# EasyEDA Pro project ProPrj_STM32F405RGT6机器人主控板_2024-12-01.epro, schematic Schematic1

## Sheets
1 P1: Create Date: 2024-09-21; Page Name: P1; Project Name: STM32F405RGT6机器人主控板; Schematic Name: Schematic1; Update Date: 2024-09-21; Company: 嘉立创EDA; Page Size: A4; Version: V1.0
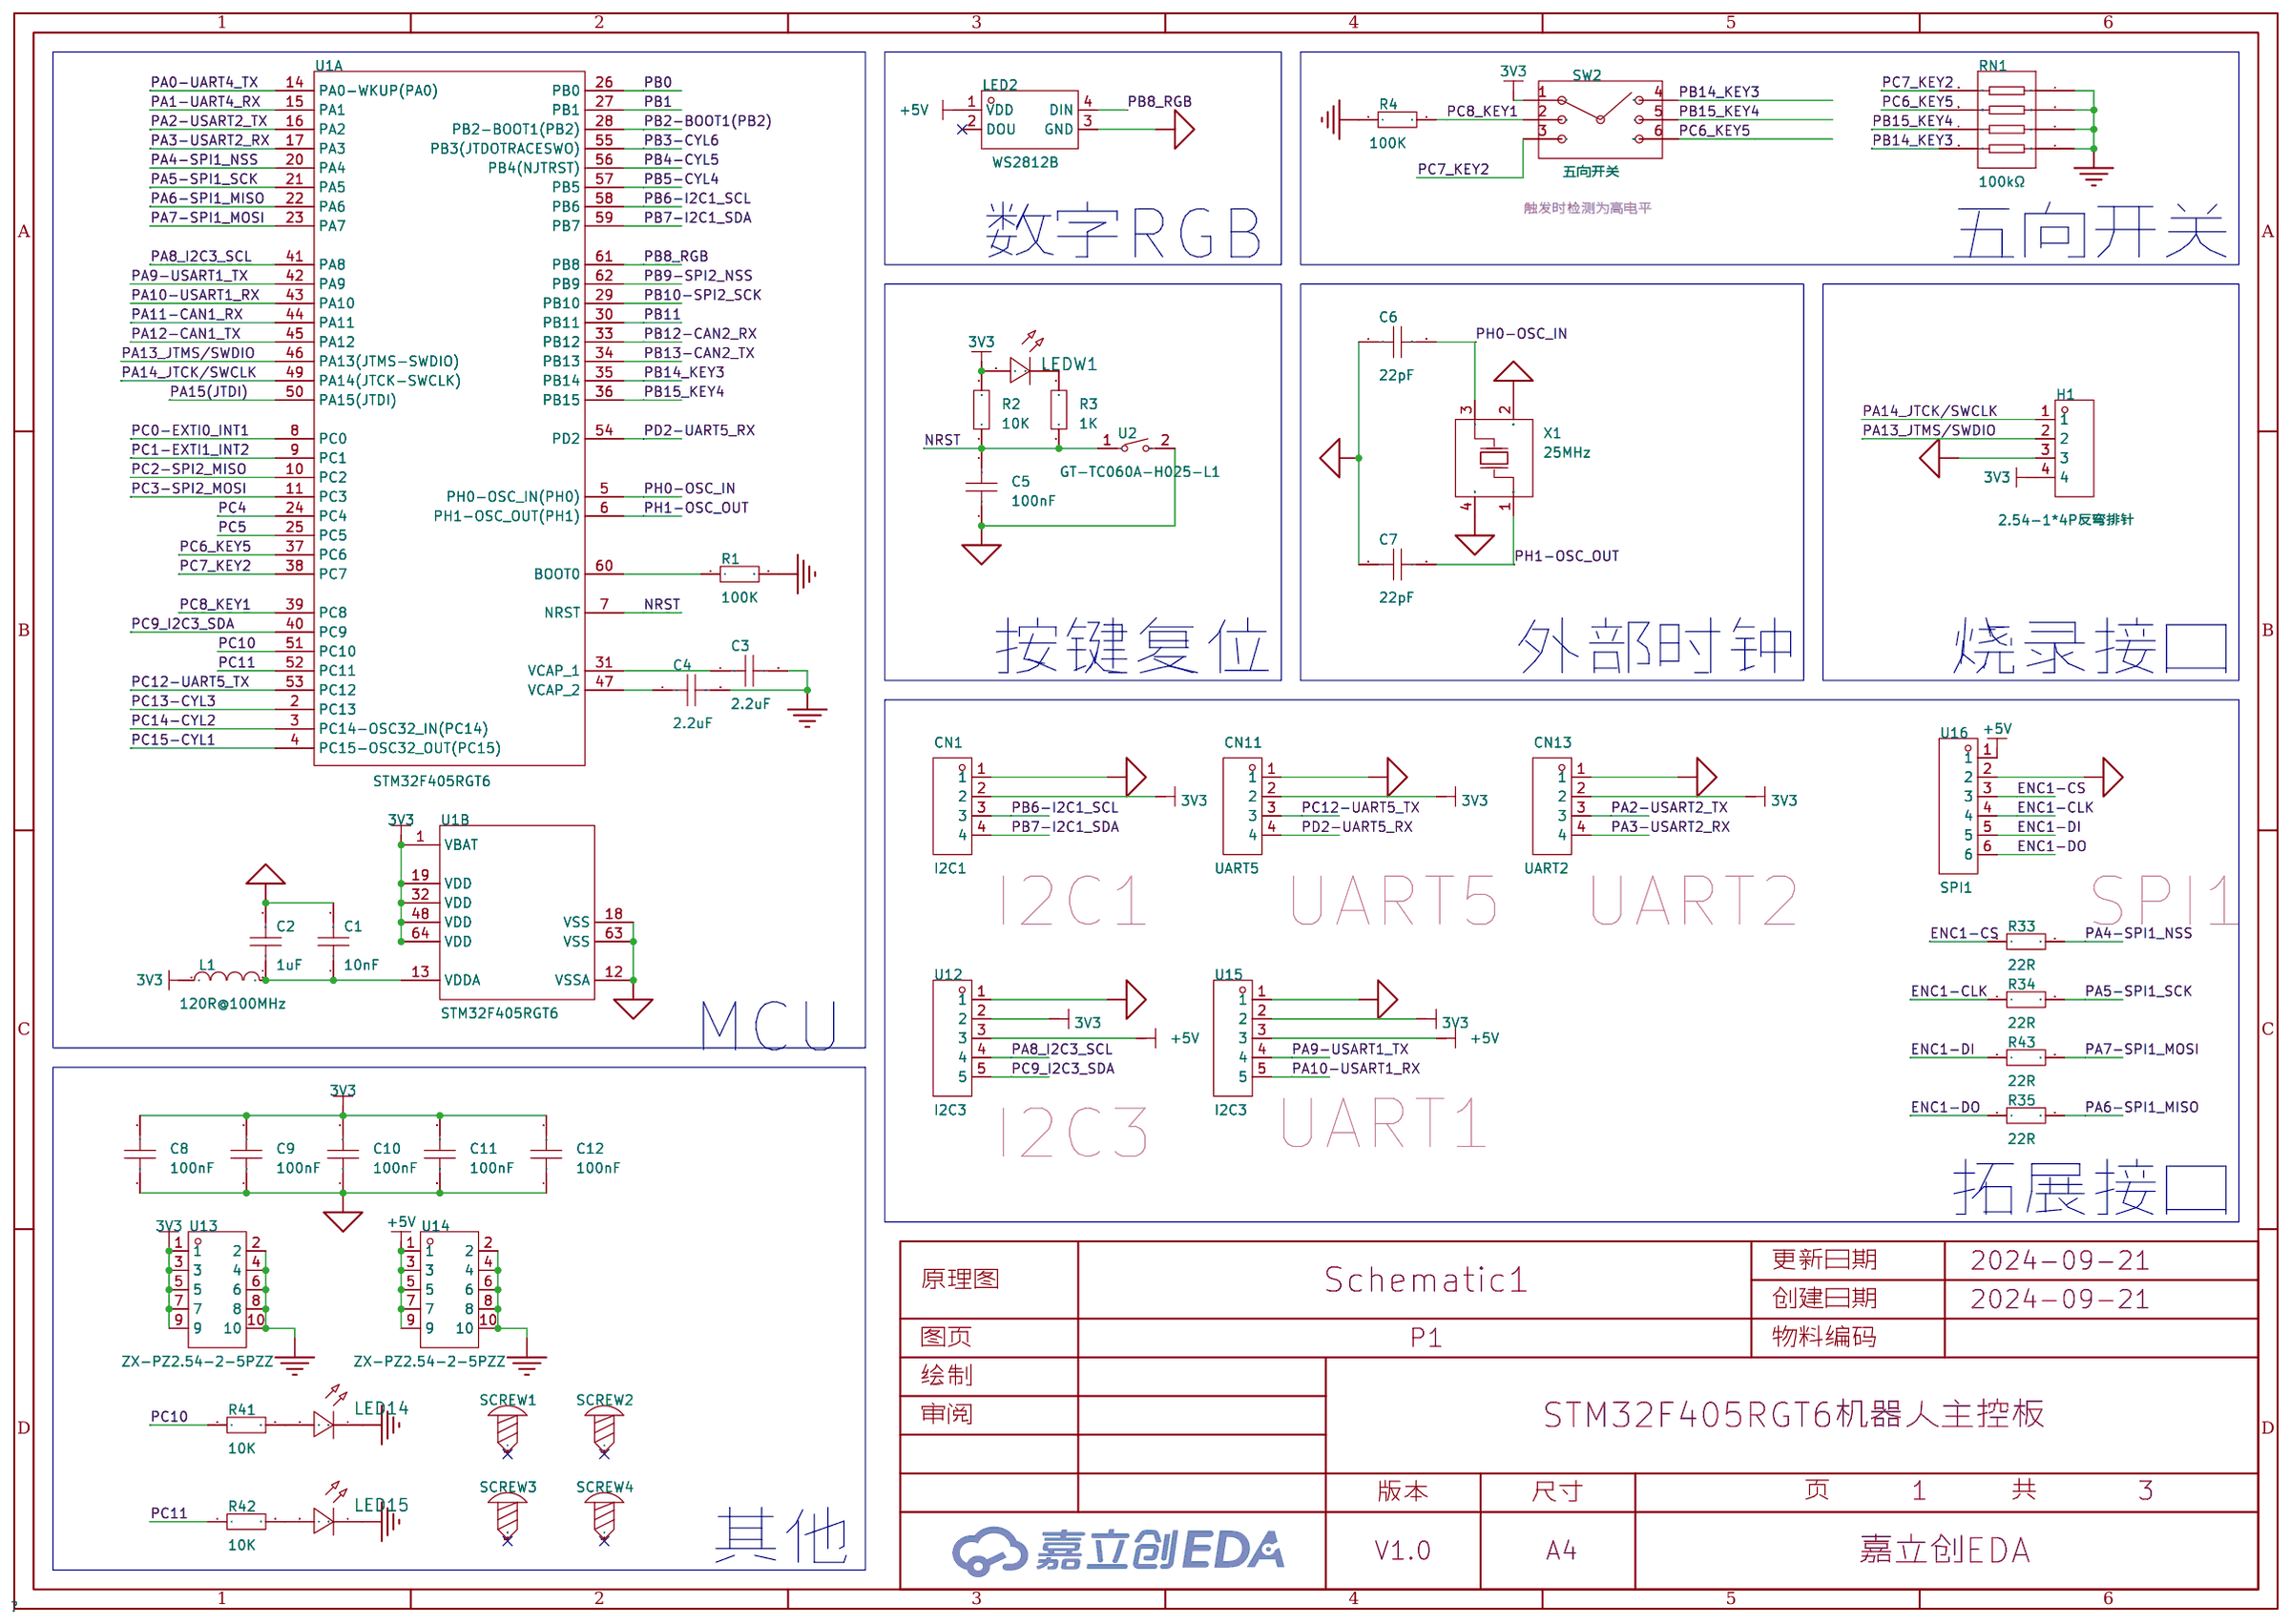
[diagram p0: P1]
2 P2: Page Name: P2; Update Date: 2024-09-22
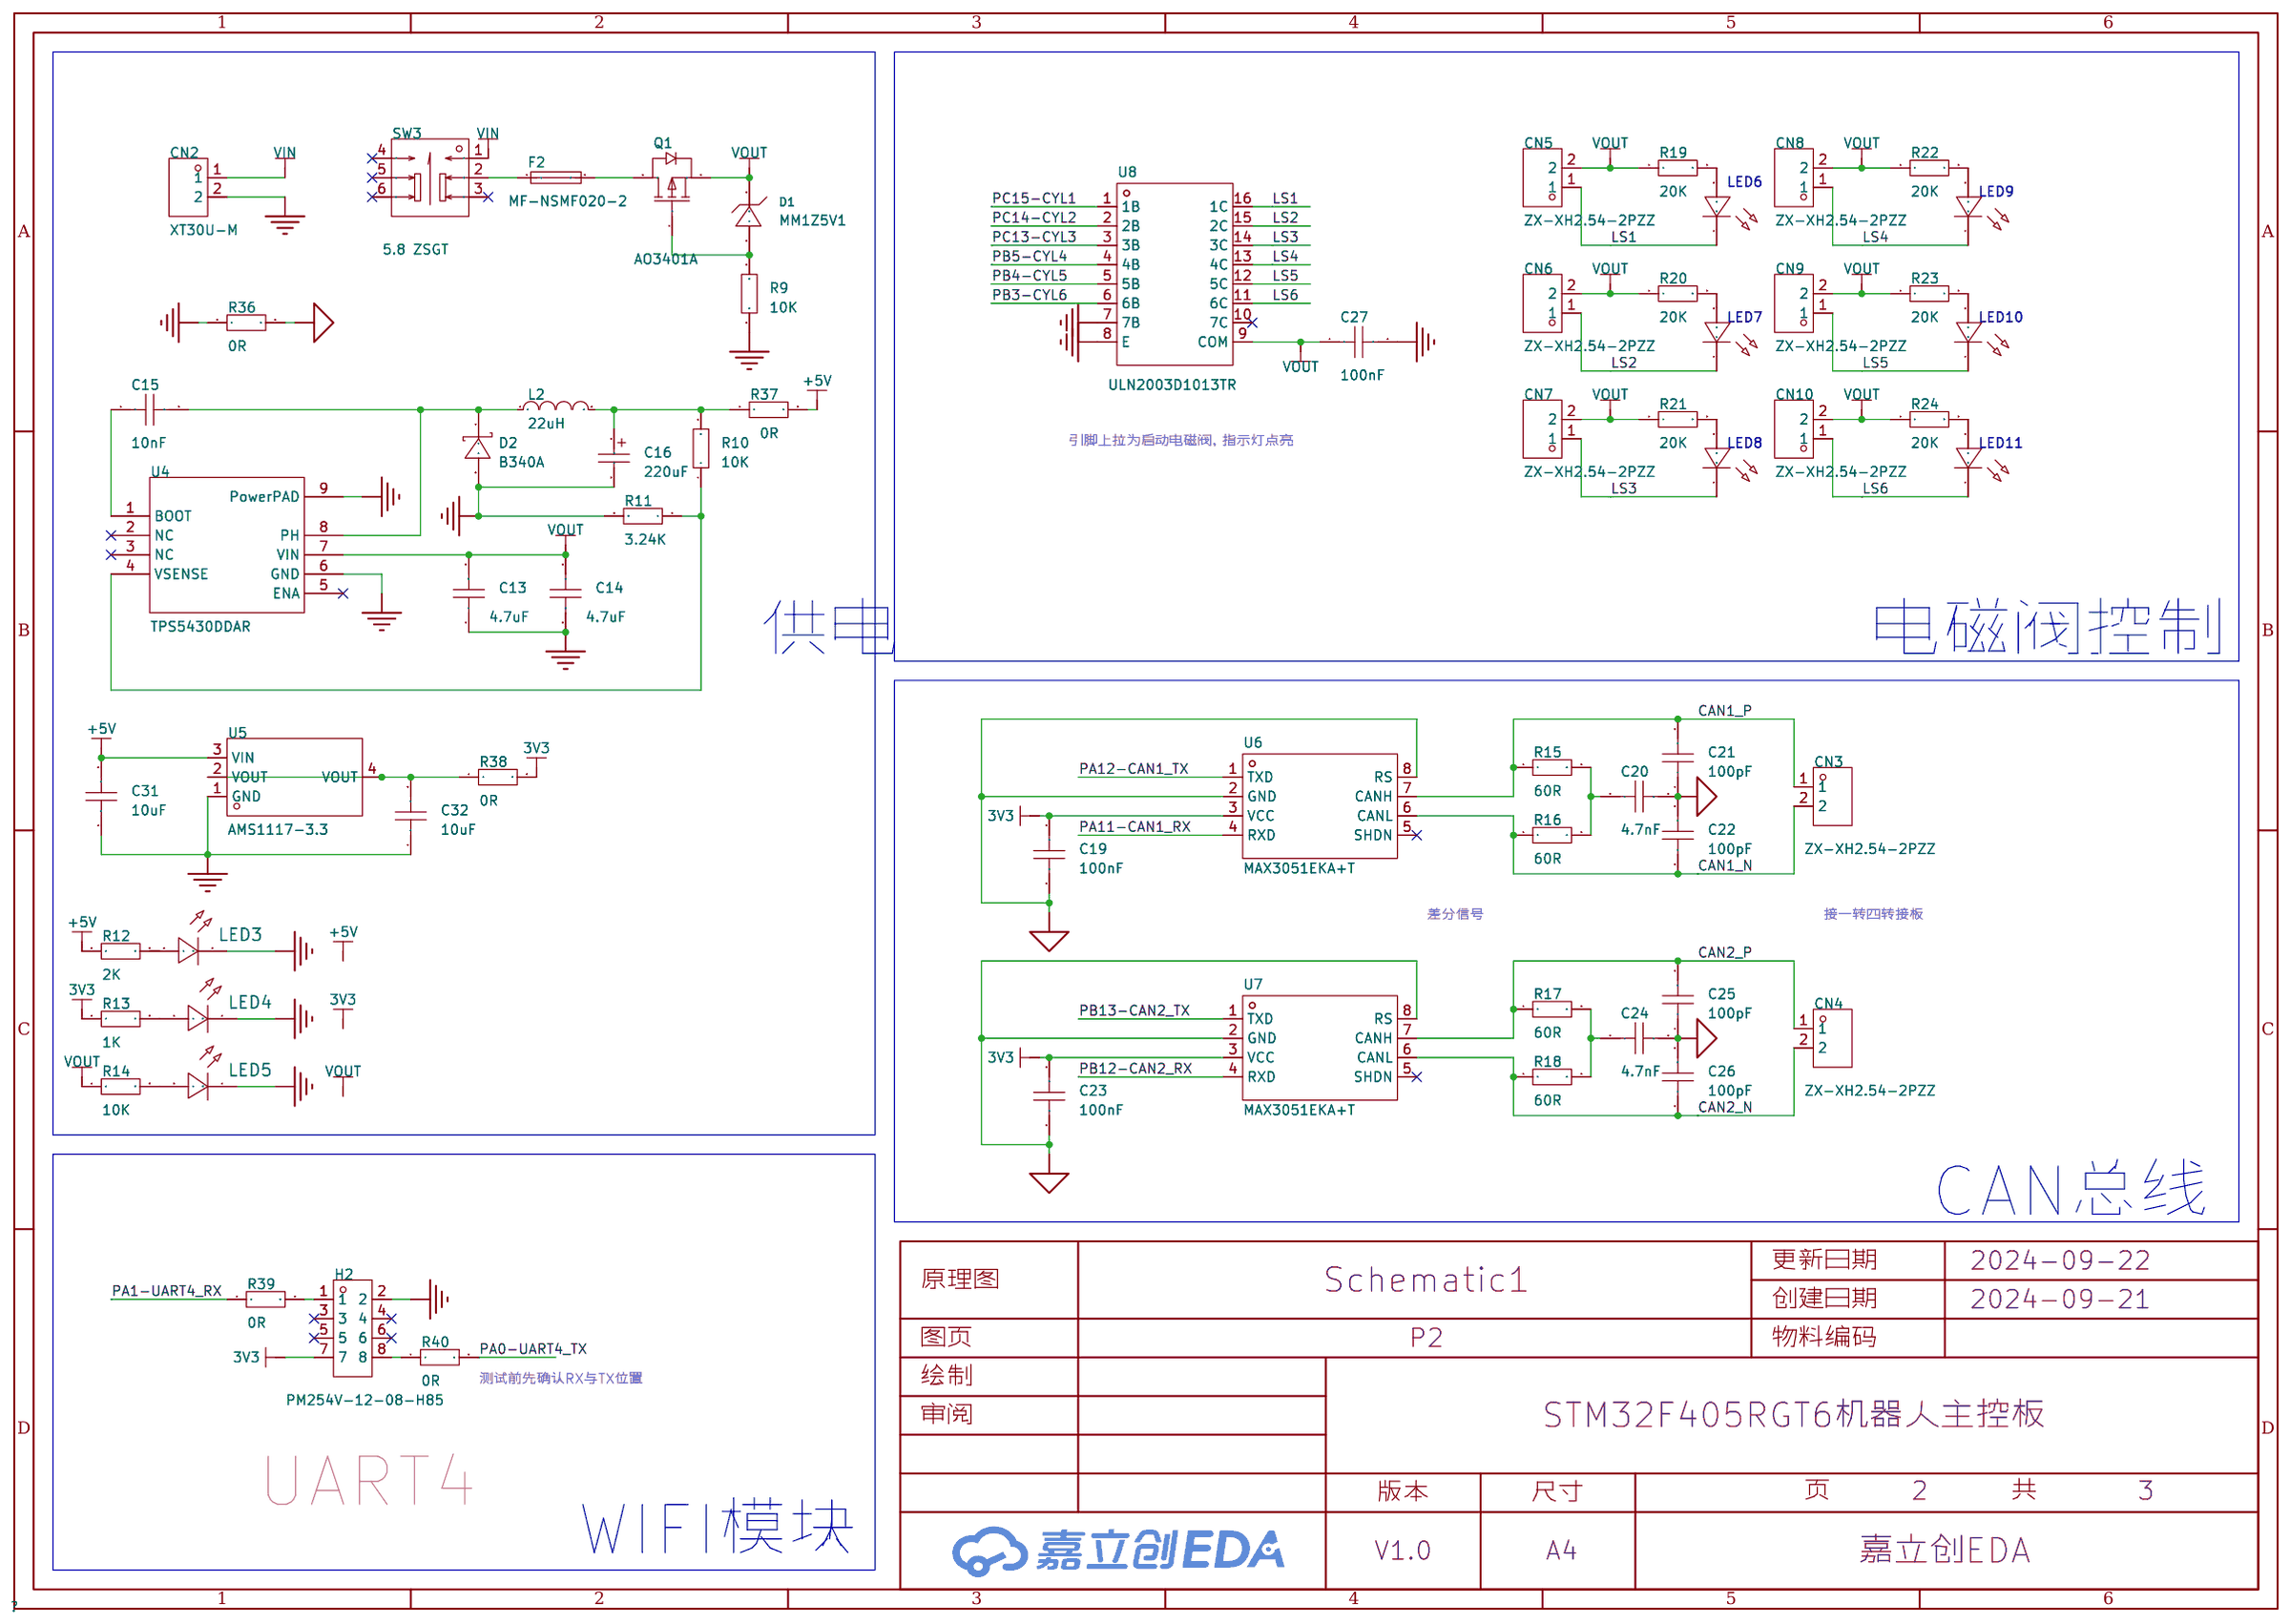
[diagram p1: P2]
3 P3: Page Name: P3; Update Date: 2024-09-22
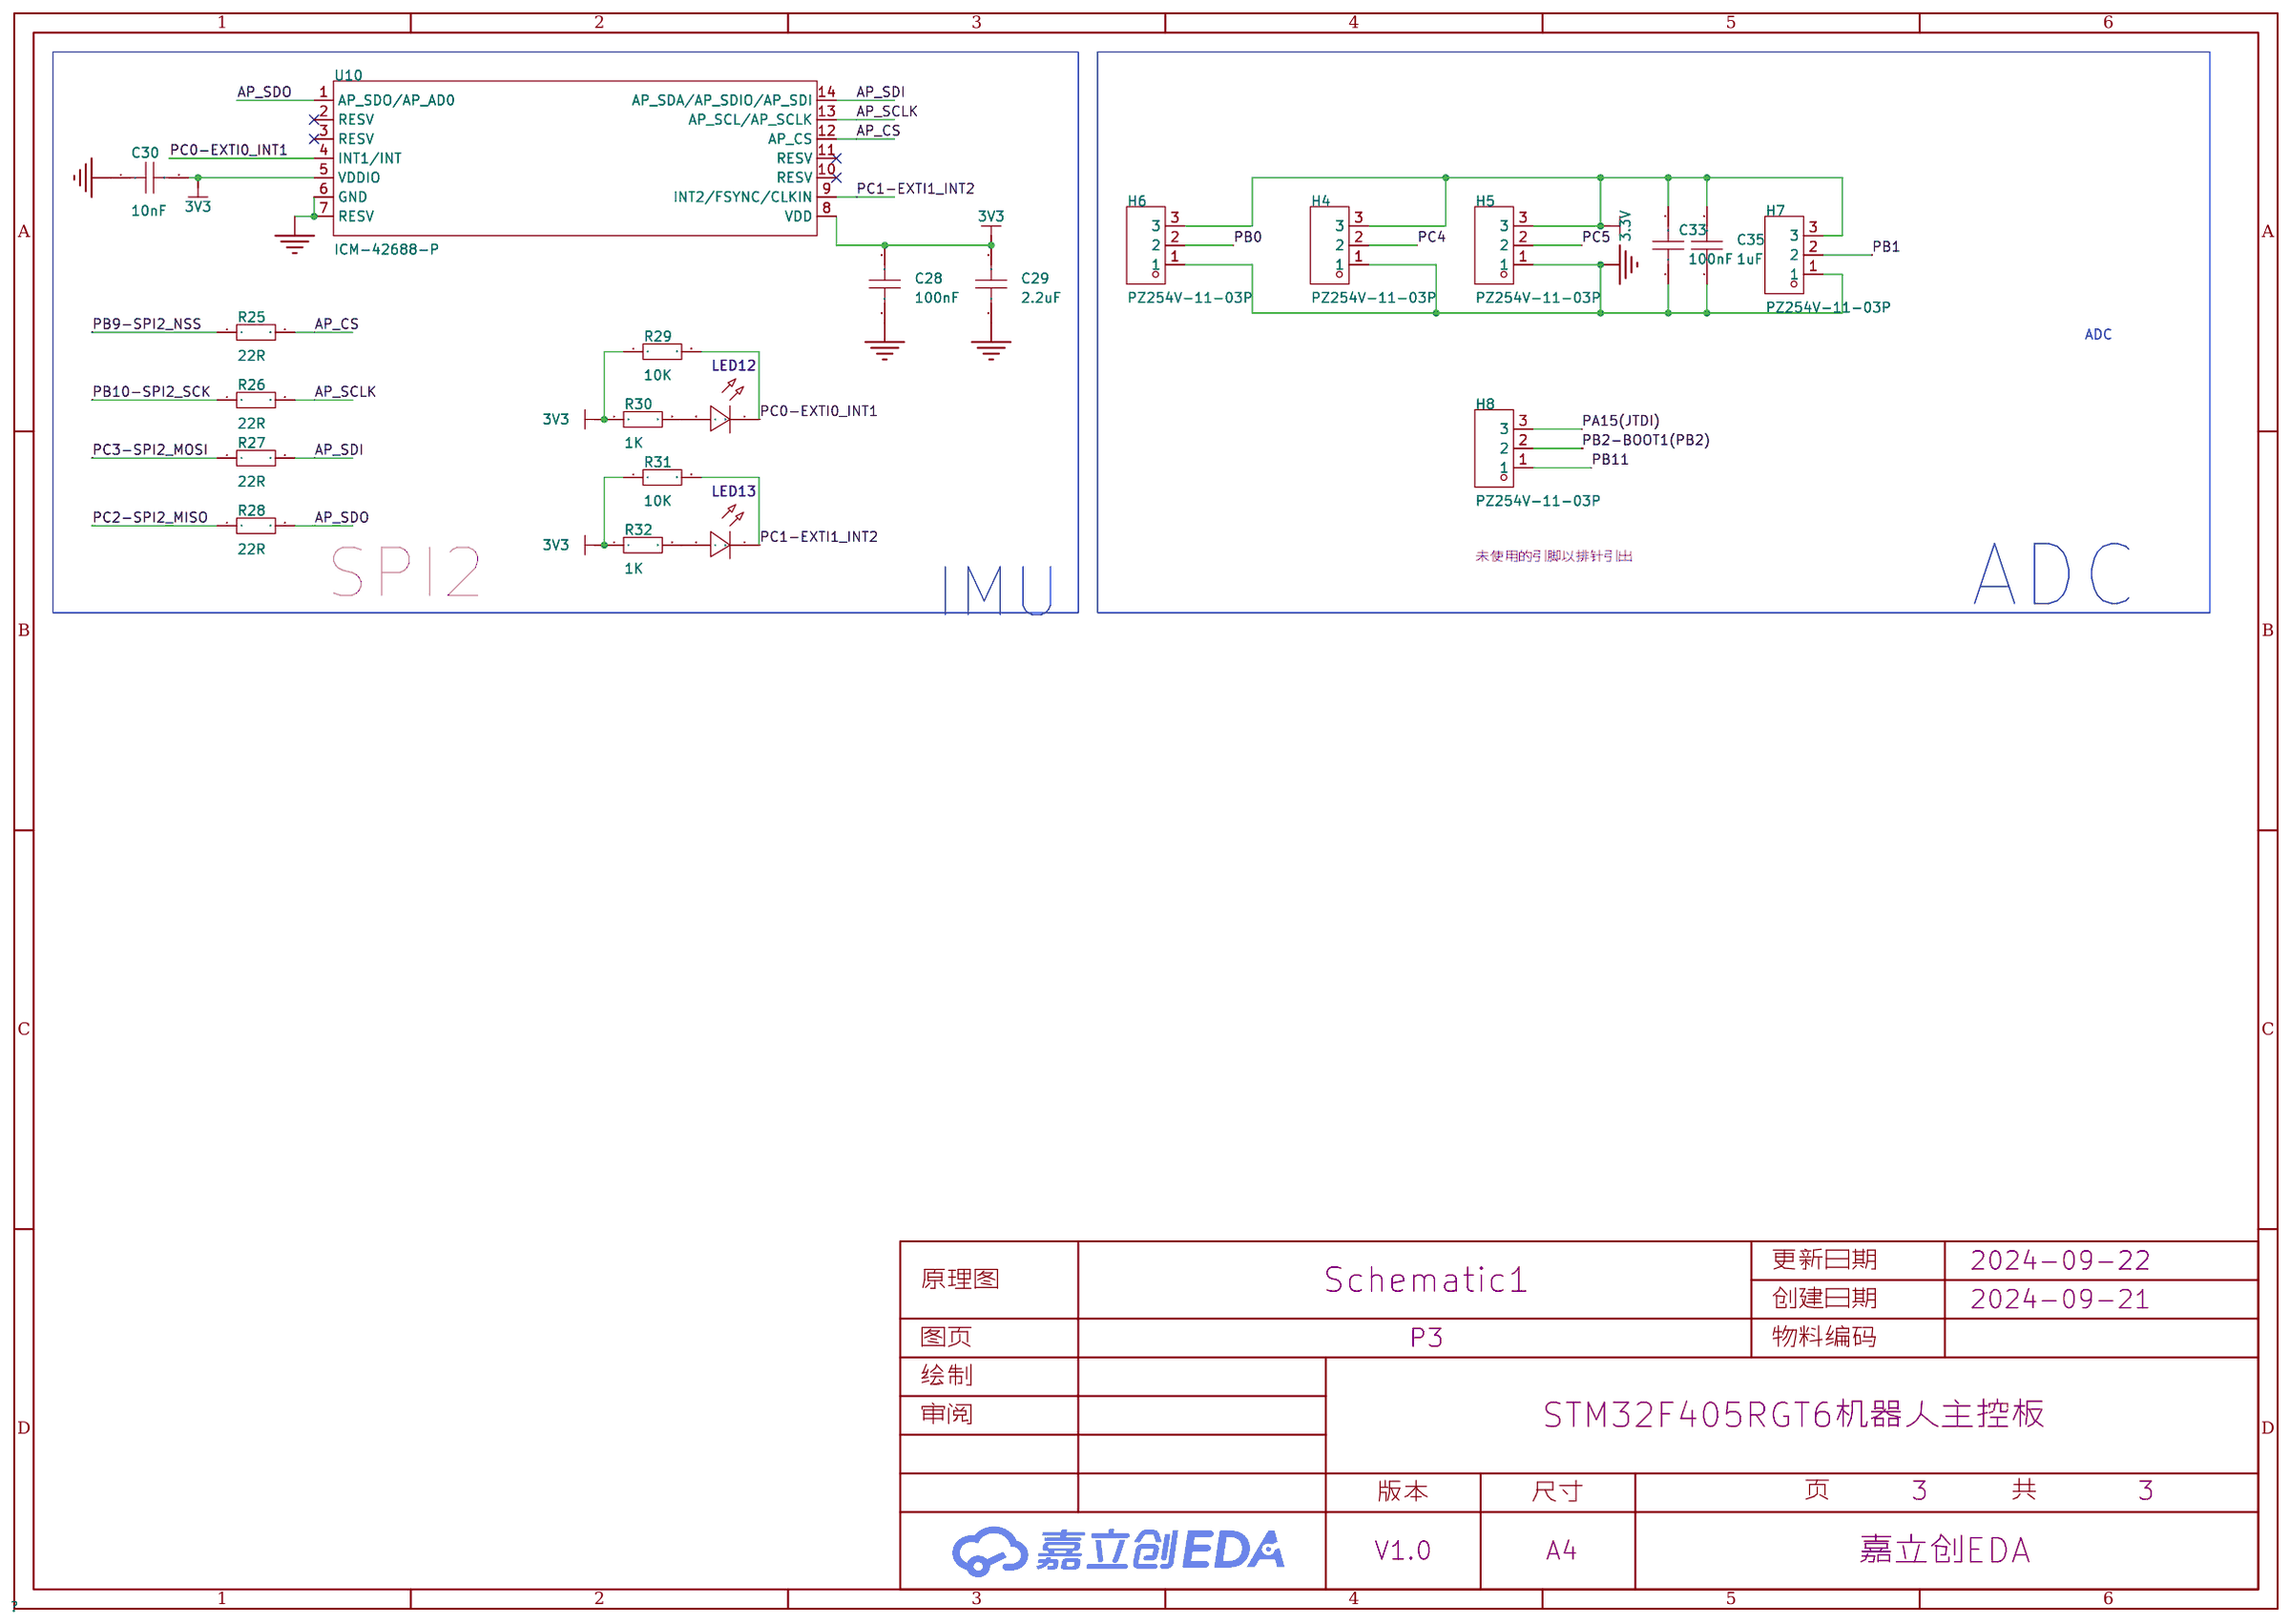
[diagram p2: P3]

## Parts
sheet P1
C1  10nF  [C0603]
C2  1uF  [C0603]
C3  2.2uF  [C0603]
C4  2.2uF  [C0603]
C5  100nF  [C0603]
C6  22pF  [C0603]
C7  22pF  [C0603]
C8  100nF  [C0603]
C9  100nF  [C0603]
C10  100nF  [C0603]
C11  100nF  [C0603]
C12  100nF  [C0603]
CN1  I2C1  [CONN-TH_4P-P2.50_4PIN]
CN11  UART5  [CONN-TH_4P-P2.50_4PIN]
CN13  UART2  [CONN-TH_4P-P2.50_4PIN]
H1  2.54-1*4P反弯排针  [HDR-TH_4P-P2.54-H-M-W10.4]
L1  120R@100MHz  [L0603]
LED2  WS2812B  [LED-SMD_4P-L5.0-W5.0-BL_XL-5050RGBC]
LED14  -  [LED_0603]
LED15  -  [LED_0603]
LEDW1  -  [LED_0603]
R1  100K  [R0603]
R2  10K  [R0603]
R3  1K  [R0603]
R4  100K  [R0603]
R33  22R  [R0603]
R34  22R  [R0603]
R35  22R  [R0603]
R41  10K  [R0603]
R42  10K  [R0603]
R43  22R  [R0603]
RN1  100kΩ  [RES-ARRAY-SMD_0603-8P-L3.2-W1.6-BL]
SCREW1  -  [M3螺丝]
SCREW2  -  [M3螺丝]
SCREW3  -  [M3螺丝]
SCREW4  -  [M3螺丝]
SW2  五向开关  [SW-SMD_K1-1504SA-06]
U1  STM32F405RGT6  [LQFP-64_L10.0-W10.0-P0.50-LS12.0-BL]  (sections 1,2)
U2  GT-TC060A-H025-L1  [SW-SMD_L6.1-W3.5-LS8.0]
U12  I2C3  [CONN-TH_5P-P2.50_ZX-XH2.54-5PZZ]
U13  ZX-PZ2.54-2-5PZZ  [HDR-TH_10P-P2.54-V-M-R2-C5-S2.54]
U14  ZX-PZ2.54-2-5PZZ  [HDR-TH_10P-P2.54-V-M-R2-C5-S2.54]
U15  I2C3  [CONN-TH_5P-P2.50_ZX-XH2.54-5PZZ]
U16  SPI1  [CONN-TH_6P-P2.50_ZX-XH2.54-6PZZ]
X1  25MHz  [OSC-SMD_4P-L3.2-W2.5-BL]
sheet P2
C13  4.7uF  [C1206]
C14  4.7uF  [C1206]
C15  10nF  [C0603]
C16  220uF  [CASE-B_3528]
C19  100nF  [C0603]
C20  4.7nF  [C0603]
C21  100pF  [C0603]
C22  100pF  [C0603]
C23  100nF  [C0603]
C24  4.7nF  [C0603]
C25  100pF  [C0603]
C26  100pF  [C0603]
C27  100nF  [C0603]
C31  10uF  [C1210]
C32  10uF  [C1210]
CN2  XT30U-M  [CONN-TH_XT30U-M]
CN3  ZX-XH2.54-2PZZ  [CONN-TH_2P-P2.50_HX25003-2A]
CN4  ZX-XH2.54-2PZZ  [CONN-TH_2P-P2.50_HX25003-2A]
CN5  ZX-XH2.54-2PZZ  [CONN-TH_2P-P2.50_HX25003-2A]
CN6  ZX-XH2.54-2PZZ  [CONN-TH_2P-P2.50_HX25003-2A]
CN7  ZX-XH2.54-2PZZ  [CONN-TH_2P-P2.50_HX25003-2A]
CN8  ZX-XH2.54-2PZZ  [CONN-TH_2P-P2.50_HX25003-2A]
CN9  ZX-XH2.54-2PZZ  [CONN-TH_2P-P2.50_HX25003-2A]
CN10  ZX-XH2.54-2PZZ  [CONN-TH_2P-P2.50_HX25003-2A]
D1  MM1Z5V1  [SOD-123_L2.8-W1.8-LS3.7-RD]
D2  B340A  [SMA_L4.3-W2.6-LS5.1-RD]
F2  MF-NSMF020-2  [F1206]
H2  PM254V-12-08-H85  [HDR-TH_8P-P2.54-V-F-R2-C4-S2.54]
L2  22uH  [IND-SMD_L4.0-W4.0_LQH44PN2R2MP0L]
LED3  -  [LED_0603]
LED4  -  [LED_0603]
LED5  -  [LED_0603]
LED6  -  [LED_0603]
LED7  -  [LED_0603]
LED8  -  [LED_0603]
LED9  -  [LED_0603]
LED10  -  [LED_0603]
LED11  -  [LED_0603]
Q1  AO3401A  [SOT-23_L2.9-W1.3-P1.90-LS2.4-BR]
R9  10K  [R0603]
R10  10K  [R0603]
R11  3.24K  [R0603]
R12  2K  [R0603]
R13  1K  [R0603]
R14  10K  [R0603]
R15  60R  [R0603]
R16  60R  [R0603]
R17  60R  [R0603]
R18  60R  [R0603]
R19  20K  [R0603]
R20  20K  [R0603]
R21  20K  [R0603]
R22  20K  [R0603]
R23  20K  [R0603]
R24  20K  [R0603]
R36  0R  [R0603]
R37  0R  [R0603]
R38  0R  [R0603]
R39  0R  [R0603]
R40  0R  [R0603]
SW3  5.8 ZSGT  [SW-TH_5.8ZSGT]
U4  TPS5430DDAR  [ESOP-8_L4.9-W3.9-P1.27-LS6.0-TL-EP]
U5  AMS1117-3.3  [SOT-223-3_L6.5-W3.4-P2.30-LS7.0-BR]
U6  MAX3051EKA+T  [SOT-23-8_L3.0-W1.7-P0.65-LS2.8-TL]
U7  MAX3051EKA+T  [SOT-23-8_L3.0-W1.7-P0.65-LS2.8-TL]
U8  ULN2003D1013TR  [SOIC-16_L9.9-W3.9-P1.27-LS6.0-BL]
sheet P3
C28  100nF  [C0603]
C29  2.2uF  [C0603]
C30  10nF  [C0603]
C33  100nF  [C0805]
C35  1uF  [C0603]
H4  PZ254V-11-03P  [HDR-TH_3P-P2.54-V-M]
H5  PZ254V-11-03P  [HDR-TH_3P-P2.54-V-M]
H6  PZ254V-11-03P  [HDR-TH_3P-P2.54-V-M]
H7  PZ254V-11-03P  [HDR-TH_3P-P2.54-V-M]
H8  PZ254V-11-03P  [HDR-TH_3P-P2.54-V-M]
LED12  -  [LED_0603]
LED13  -  [LED_0603]
R25  22R  [R0603]
R26  22R  [R0603]
R27  22R  [R0603]
R28  22R  [R0603]
R29  10K  [R0603]
R30  1K  [R0603]
R31  10K  [R0603]
R32  1K  [R0603]
U10  ICM-42688-P  [LGA-14_L3.0-W2.5-P0.50-TL]

## Library data of the parts
C1-C12 C15 C19-C30 = CAP_0603: Supplier Footprint: 0603
CN1 CN11 CN13 = ZX-XH2.54-4PZZ: 插针结构:1x4P;间距:2.54mm;安装方式:直插;参考系列:XH;总PIN数:4P;排数:1;每排PIN数:4;行距:-;额定电流:3A;触头材质:黄铜;触头镀层:锡;工作温度范围:-25℃~+85℃;; Supplier Part: C7429634; Manufacturer: Megastar(兆星); Supplier Footprint: 插件,P=2.54mm; JLCPCB Part Class: 扩展库; Datasheet: https://atta.szlcsc.com/upload/public/pdf/source/20230619/B529A2163E0159A644AB3383D208FB03.pdf; Supplier: LCSC; Pins Structure: 1x4P; Pitch: 2.54mm; Mounting Style: 直插; Reference Series: XH; Number of Pins: 4P; Number of Rows: 1; Number of PINs Per Row: 4; Current Rating (Max): 3A; Contact Material: 黄铜; Contact Plating: 锡; Operating Temperature Range: -25℃~+85℃
H1 = 2.54-1*4P反弯排针: 插针结构:1x4P;间距:2.54mm;行距:-;圆针/方针:方针;安装类型:弯插;排数:单排;总PIN位数:4P;额定电流:3A;额定电压:-;配合针长度:6mm;塑高:-;端接针长度:-;触头材质:-;触头镀层:-;工作温度范围:-55℃~+105℃;颜色:黑色;; LCSC Part Name: 间距:2.54mm 1x4P 弯插 方针; Supplier Part: C91552; Manufacturer: BOOMELE(博穆精密); Supplier Footprint: 弯插,P=2.54mm; JLCPCB Part Class: 扩展库; Datasheet: https://atta.szlcsc.com/upload/public/pdf/source/20190508/C74252_03DDEC4696EE17172E44B96636392962.pdf; Supplier: LCSC; Pin Structure: 1x4P; Pitch: 2.54mm; Circluar Pins/Square Pins: 方针; Mounting Type: 弯插; Number of Rows: 单排; Number of Pins: 4P; Current Rating (Max): 3A; Length of Mating Pin: 6mm; Operating Temperature Range: -55℃~+105℃; Color: 黑色
L1 = BLM18PG121SN1D: 标称阻抗@测试频率:120Ω@100MHz;误差:±25%;直流电阻(RDC):50mΩ;; LCSC Part Name: 单路 0603磁珠 阻抗120Ω@100MHz; Supplier Part: C14709; Manufacturer: muRata(村田); Supplier Footprint: 0603; JLCPCB Part Class: 扩展库; Datasheet: https://atta.szlcsc.com/upload/public/pdf/source/20130704/1457706621422.pdf; Supplier: LCSC; Impedance @ Frequency: 120Ω@100MHz; Tolerance: ±25%; DC Resistance: 50mΩ; Current Rating: 2A; Circuits: 1
LED2 = XL-5050RGBC-WS2812B: 5050七彩幻彩透明贴片LED灯珠 5050 幻彩透明四脚 ws2812B 内置驱动IC; Supplier Part: C2843785; Manufacturer: XINGLIGHT(成兴光); Supplier Footprint: SMD5050; JLCPCB Part Class: 扩展库; Datasheet: https://atta.szlcsc.com/upload/public/pdf/source/20240412/E1004CAA80592E31D08BFE019083806F.pdf; Supplier: LCSC
LED3-LED5 LED14 LED15 LEDW1 = LED_0603-R: Supplier Footprint: 0603
R1-R4 R9-R43 = Res_0603: Supplier Footprint: 0603
RN1 = 4D03WGF1003T5E: 电阻器数:4;阻值:100kΩ;精度:±1%;单个元件功率:62.5mW;温度系数:±200ppm/℃;; LCSC Part Name: 100kΩ ±1%; Supplier Part: C173315; Manufacturer: UNI-ROYAL(厚声); Supplier Footprint: 0603x4; JLCPCB Part Class: 扩展库; Datasheet: https://atta.szlcsc.com/upload/public/pdf/source/20191224/C474318_2527498AE30E813171187CCD28401A71.pdf; Supplier: LCSC; Number of Resistors: 4; Tolerance: ±1%; Power(Watts): 62.5mW; Temperature Coefficient: ±200ppm/℃; Number of Pins: 8
SCREW1-SCREW4 = M3螺丝: Supplier Footprint: 插件
SW2 = K1-1504SA-06: Supplier Part: C136712; Manufacturer: 韩国韩荣; Supplier Footprint: SMD,10x10mm; JLCPCB Part Class: 扩展库; Datasheet: https://atta.szlcsc.com/upload/public/pdf/source/20210810/C19E165DEB2C09DE28F28226FC5359B8.pdf; Supplier: LCSC
U1 = STM32F405RGT6: CPU内核:ARM-M4;程序存储容量:1MB;RAM总容量:192KB;GPIO端口数量:51;工作电压范围:1.8V~3.6V;CPU最大主频:168MHz;程序存储器类型:FLASH;; LCSC Part Name: 带DSP和FPU的高性能基础系列ARM Cortex-M4 MCU，具有1 MB Flash、168 MHz CPU和ART加速器; Supplier Part: C15742; Manufacturer: ST(意法半导体); Supplier Footprint: LQFP-64(10x10); JLCPCB Part Class: 扩展库; Datasheet: https://atta.szlcsc.com/upload/public/pdf/source/20140801/1457707197138.pdf; Supplier: LCSC; CPU Core: ARM-M4; Program Storage Size: 1MB; RAM Size: 192KB; GPIO Ports Number: 51; Operating Voltage Range: 1.8V~3.6V; CPU Maximum Speed: 168MHz; Program Memory Type: FLASH; Operating Temperature Range: -40℃~+85℃; ADC (Bit): 12bit; DAC (Bit): 12bit; Universal Serial Bus: 有; Peripheral/Function: DMA；LCD/LED驱动；PWM; Watchdog: 有; Infrared Data Association: 有; Low-Voltage Detect: 有; LCD Module: 有; Direct Memory Access: 有; Internal Oscillator: 有
U2 = GT-TC060A-H025-L1: 电路结构:单刀单掷;按钮形状:矩形按钮;作用力:1.6N;安装方式:立贴;开关长度:6.05mm;开关宽度:3.5mm;开关高度:2.5mm;带支架:不带;触点电流:50mA;额定电压(AC):-;额定电压(DC):12V;绝缘电阻:100MΩ;带灯:无;机械寿命:10万次;; LCSC Part Name: 3x6 两脚立式轻触开关 H2.5mm 160gf; Supplier Part: C5117870; Manufacturer: G-Switch(品赞); Supplier Footprint: SMD; JLCPCB Part Class: 扩展库; Datasheet: https://atta.szlcsc.com/upload/public/pdf/source/20220727/66542626AE211ABCA7EA42BB18BFEDDD.pdf; Supplier: LCSC; Circuit: 单刀单掷; Actuator Style: 矩形按钮; Operating Force: 1.6N; Mounting Style: 立贴; Switch Length: 6.05mm; Switch Width: 3.5mm; Switch Height: 2.5mm; Strike Gundam: 不带; Contact Current: 50mA; Voltage Rating (DC): 12V; Insulation Resistance: 100MΩ; Actuator/Cap Color: 白色; With Lamp: 无; Pin Style: PC引脚; Mechanical Life: 10万次; Operating Temperature: -30℃~+85℃
U12 U15 = ZX-XH2.54-5PZZ: 插针结构:1x5P;间距:2.54mm;安装方式:直插;参考系列:XH;总PIN数:5P;排数:1;每排PIN数:5;行距:-;额定电流:3A;触头材质:黄铜;触头镀层:锡;工作温度范围:-25℃~+85℃;; Supplier Part: C7429635; Manufacturer: Megastar(兆星); Supplier Footprint: 插件,P=2.54mm; JLCPCB Part Class: 扩展库; Datasheet: https://atta.szlcsc.com/upload/public/pdf/source/20230619/60EEF4ADD558E90BFFACF5D939816781.pdf; Supplier: LCSC; Pins Structure: 1x5P; Pitch: 2.54mm; Mounting Style: 直插; Reference Series: XH; Number of Pins: 5P; Number of Rows: 1; Number of PINs Per Row: 5; Current Rating (Max): 3A; Contact Material: 黄铜; Contact Plating: 锡; Operating Temperature Range: -25℃~+85℃
U13 U14 = ZX-PZ2.54-2-5PZZ: 插针结构:2x5P;间距:2.54mm;行距:2.54mm;圆针/方针:方针;安装类型:直插;排数:双排;总PIN位数:10P;额定电流:3A;额定电压:1kV;配合针长度:6mm;塑高:2.5mm;端接针长度:3mm;触头材质:黄铜;触头镀层:金;工作温度范围:-40℃~+105℃;焊接温度(最大值):-;颜色:黑色;; LCSC Part Name: 2x5P 间距:2.54mm 方针 直插; Supplier Part: C7501276; Manufacturer: Megastar(兆星); Supplier Footprint: 插件,P=2.54mm; JLCPCB Part Class: 扩展库; Datasheet: https://atta.szlcsc.com/upload/public/pdf/source/20231122/7DD2FA5A7FDBC10CDDB6051CB6BC6AD1.pdf; Supplier: LCSC; Pin Structure: 2x5P; Pitch: 2.54mm; Row Spacing: 2.54mm; Circluar Pins/Square Pins: 方针; Mounting Type: 直插; Number of Rows: 双排; Number of Pins: 10P; Current Rating (Max): 3A; Voltage Rating (Max): 1kV; Length of Mating Pin: 6mm; Insulation Height: 2.5mm; Length of End Connection Pin: 3mm; Contact Material: 黄铜; Contact Plating: 金; Operating Temperature Range: -40℃~+105℃; Color: 黑色
U16 = ZX-XH2.54-6PZZ: 插针结构:1x6P;间距:2.54mm;安装方式:直插;参考系列:XH;总PIN数:6P;排数:1;每排PIN数:6;行距:-;额定电流:3A;触头材质:黄铜;触头镀层:锡;工作温度范围:-25℃~+85℃;; Supplier Part: C7429636; Manufacturer: Megastar(兆星); Supplier Footprint: 插件,P=2.54mm; JLCPCB Part Class: 扩展库; Datasheet: https://atta.szlcsc.com/upload/public/pdf/source/20230619/1243AD0A516E39CD3D274D8985780568.pdf; Supplier: LCSC; Pins Structure: 1x6P; Pitch: 2.54mm; Mounting Style: 直插; Reference Series: XH; Number of Pins: 6P; Number of Rows: 1; Number of PINs Per Row: 6; Current Rating (Max): 3A; Contact Material: 黄铜; Contact Plating: 锡; Operating Temperature Range: -25℃~+85℃
X1 = X322525MSB4SI: 晶振类型:贴片晶振;频率:25MHz;常温频差:±10ppm;外接负载电容:20pF;频率稳定度(全温):±20ppm;; LCSC Part Name: 25MHz ±10ppm 20pF; Supplier Part: C13740; Manufacturer: YXC(扬兴晶振); Supplier Footprint: SMD3225-4P; JLCPCB Part Class: 扩展库; Datasheet: https://atta.szlcsc.com/upload/public/pdf/source/20240329/19D5F850207469550BEB00D7DFEDBC7A.pdf; Supplier: LCSC; Crystal Type: 贴片晶振; Normal temperature Frequency Tolerance: ±10ppm; External load capacitor: 20pF; Frequency Stability(Full temperature range): ±20ppm; Operating Temperature: -40℃~+85℃
C13 C14 = CAP_1206: Supplier Footprint: 1206
C16 = TLJB227M006R0500: 容值:220uF;精度:±20%;额定电压:6.3V;等效串联电阻:500mΩ@100kHz;; LCSC Part Name: 220uF ±20% 6.3V; Supplier Part: C30242; Manufacturer: Kyocera AVX; Supplier Footprint: CASE-B-3528; JLCPCB Part Class: 扩展库; Datasheet: https://atta.szlcsc.com/upload/public/pdf/source/20181016/C313517_95E099C94D57B8A6005DAF15C3058A23.pdf; Supplier: LCSC; Tolerance: ±20%; Rated Voltage: 6.3V; Equivalent Series Resistance(ESR): 500mΩ@100kHz; Operating Temperature: -55℃~+125℃
C31 C32 = FS32X106K101EGG: 容值:10uF;精度:±10%;额定电压:100V;材质(温度系数):X7R;; LCSC Part Name: 10uF ±10% 100V; Supplier Part: C5156756; Manufacturer: PSA(信昌电陶); Supplier Footprint: 1210; JLCPCB Part Class: 扩展库; Datasheet: https://atta.szlcsc.com/upload/public/pdf/source/20220906/2A42A90825742552985FFB5A7BAB200E.pdf; Supplier: LCSC; Tolerance: ±10%; Voltage Rated: 100V; Temperature Coefficient: X7R
CN2 = XT30U-M: 类别:-;类型1:-;; LCSC Part Name: AMASS(艾迈斯)轻量版锂电池插头公头 XT30U-M; Supplier Part: C99101; Manufacturer: AMASS(艾迈斯); JLCPCB Part Class: 扩展库; Datasheet: https://atta.szlcsc.com/upload/public/pdf/source/20170606/1496716542582.pdf; Supplier: LCSC; Brand: 艾迈斯; Type: 插头; Colour: 黄色; InterfaceType: 公头
CN3-CN10 = ZX-XH2.54-2PZZ: 插针结构:1x2P;间距:2.54mm;安装方式:直插;参考系列:XH;总PIN数:2P;排数:1;每排PIN数:2;行距:-;额定电流:3A;触头材质:黄铜;触头镀层:锡;工作温度范围:-25℃~+85℃;; Supplier Part: C7429632; Manufacturer: Megastar(兆星); Supplier Footprint: 插件,P=2.54mm; JLCPCB Part Class: 扩展库; Datasheet: https://atta.szlcsc.com/upload/public/pdf/source/20230619/19BA6947230AA44A04D3EDD65E618FD0.pdf; Supplier: LCSC; Pins Structure: 1x2P; Pitch: 2.54mm; Mounting Style: 直插; Reference Series: XH; Number of Pins: 2P; Number of Rows: 1; Number of PINs Per Row: 2; Current Rating (Max): 3A; Contact Material: 黄铜; Contact Plating: 锡; Operating Temperature Range: -25℃~+85℃
D1 = MM1Z5V1_C112534: 二极管配置:独立式;稳压值(标称值):5.1V;稳压值(范围):4.8V~5.4V;功率:500mW;精度:±6%;; Supplier Part: C112534; Manufacturer: 晶导微电子; Supplier Footprint: SOD-123; JLCPCB Part Class: 扩展库; Datasheet: https://atta.szlcsc.com/upload/public/pdf/source/20190326/C382779_93A8490AC8548BE170FED91286A619FB.pdf; Supplier: LCSC; Diode Configuration: 独立式; Zener Voltage (Nom): 5.1V; Reverse Leakage Current (Ir): 2uA@1.5V; Zener Voltage (Range): 4.8V~5.4V; Power Dissipation: 500mW; Zener Impedance (Zzt): 130Ω; Tolerance: ±6%
D2 = B340A: 二极管配置:独立式;正向压降(Vf):550mV@3A;直流反向耐压(Vr):40V;整流电流:3A;; LCSC Part Name: 电压:40V 电流:3A; Supplier Part: C64982; Manufacturer: MDD(辰达半导体); Supplier Footprint: SMA(DO-214AC); JLCPCB Part Class: 扩展库; Datasheet: https://atta.szlcsc.com/upload/public/pdf/source/20230710/CC7CF81239BC87A7012E02A96905E83C.pdf; Supplier: LCSC; Diode Configuration: 独立式; Forward Voltage (Vf@If): 550mV@3A; Reverse Voltage (Vr): 40V; Rectified Current: 3A; Reverse Leakage Current (Ir): 500uA@40V
F2 = MF-NSMF020-2: 最大电压:24V;最大电流:10A;保持电流:200mA;跳闸电流:460mA;; LCSC Part Name: 24V 200mA 1206自恢复; Supplier Part: C185112; Manufacturer: BOURNS; Supplier Footprint: 1206; JLCPCB Part Class: 扩展库; Datasheet: https://atta.szlcsc.com/upload/public/pdf/source/20191121/C458750_D7E201C69B93E02417C741DC2F6EB79C.pdf; Supplier: LCSC; Operating Voltage (Max): 24V; Current Rating (Max): 10A; Hold Current: 200mA; Trip Current: 460mA; Resistance - Initial (Ri) (Min): 600mΩ; Resistance - Post Trip (R1) (Max): 2.6Ω; Maximum Time to Trip: 600ms; Operating Temperature: -40℃~+85℃
H2 = PM254V-12-08-H85: 插孔结构:2x4P;间距:2.54mm;行距:2.54mm;圆孔/方孔:方孔;安装类型:直插;排数:双排;总孔位数:8P;额定电流:3A;额定电压:250V;插孔方向:顶部;塑高:8.5mm;工作温度范围:-40℃~+105℃;; LCSC Part Name: 间距:2.54mm 2x4P 直插; Supplier Part: C2834799; Manufacturer: XFCN(兴飞); Supplier Footprint: 插件,P=2.54mm; JLCPCB Part Class: 扩展库; Datasheet: https://atta.szlcsc.com/upload/public/pdf/source/20200309/C492399_8C441E2934FBB604A89B37A68AA45ECF.pdf; Supplier: LCSC; Holes Structure: 2x4P; Pitch: 2.54mm; Row Spacing: 2.54mm; Circular Hole / Square Hole: 方孔; Mounting Type: 直插; Number of Rows: 双排; Number of Holes: 8P; Current Rating (Max): 3A; Voltage Rating (Max): 250V; Holes Direction: 顶部; Insulation Height: 8.5mm; Operating Temperature Range: -40℃~+105℃
L2 = SMNR4020-22UH: 电感值:22uH;精度:±20%;额定电流:-;饱和电流(Isat):1.05A;; LCSC Part Name: 22uH ±20% 1.05A; Supplier Part: C135264; Manufacturer: SXN(顺翔诺); Supplier Footprint: SMD,4x4x2mm; JLCPCB Part Class: 扩展库; Datasheet: https://atta.szlcsc.com/upload/public/pdf/source/20210812/995F2AD58C1C491532425584E325E086.pdf; Supplier: LCSC; Tolerance: ±20%; Saturation Current (Isat): 1.05A; DC Resistance (DCR): 455mΩ
LED6-LED12 = LED_0603-B: Supplier Footprint: 0603
Q1 = AO3401A_C15127: 类型:1个P沟道;漏源电压(Vdss):30V;连续漏极电流(Id):4A;功率(Pd):1.4W;导通电阻(RDS(on)@Vgs,Id):44mΩ@10V,4.3A;阈值电压(Vgs(th)@Id):1.3V@250uA;; LCSC Part Name: 1个P沟道 耐压:30V 电流:4A; Supplier Part: C15127; Manufacturer: AOS; Supplier Footprint: SOT-23; JLCPCB Part Class: 基础库; Datasheet: https://atta.szlcsc.com/upload/public/pdf/source/20160507/1462613609053.pdf; Supplier: LCSC; Type: 1个P沟道; Drain Source Voltage (Vdss): 30V; Continuous Drain Current (Id): 4A; Power Dissipation (Pd): 1.4W; Drain Source On Resistance (RDS(on)@Vgs,Id): 44mΩ@10V,4.3A; Gate Threshold Voltage (Vgs(th)@Id): 1.3V@250uA; Total Gate Charge (Qg@Vgs): 12.2nC@4.5V; Input Capacitance (Ciss@Vds): 1.2nF@15V; Operating Temperature: -55℃~+150℃@(Tj)
SW3 = 5.8 ZSGT: 电路结构:双刀双掷;自锁/无锁:自锁;安装方式:直插;触点电流:110mA;额定电压 (DC):30V;带灯:不带;作用力:1.5N;机械寿命:10万次;; LCSC Part Name: 5.8*5.8有头/高头 带锁/自锁开关 泡泡机开关; Supplier Part: C2681587; Manufacturer: SHOU HAN(首韩); Supplier Footprint: 插件; JLCPCB Part Class: 扩展库; Datasheet: https://atta.szlcsc.com/upload/public/pdf/source/20210107/C2681587_CDDDDA4A1C7AC9FEB01815B75893A6BA.pdf; Supplier: LCSC; Circuit: 双刀双掷; Self Lock / No Lock: 自锁; Actuator Style: 方形按钮; Mounting Style: 直插; Contact Current: 110mA; Voltage Rating (DC): 30V; Insulation Resistance: 100MΩ; Actuator/Cap Color: 白色; With Lamp: 不带; Pin Style: PC引脚; Operating Force: 1.5N; Operating Temperature: -10℃~+70℃; Mechanical Life: 10万次
U4 = TPS5430DDAR: 功能类型:降压型;输出类型:可调;输入电压:5.5V~36V;输出电压:1.221V~32.04V;输出电流(最大值):3A;; LCSC Part Name: 降压 3A 36V; Supplier Part: C9864; Manufacturer: TI(德州仪器); Supplier Footprint: SOIC-8-EP; JLCPCB Part Class: 基础库; Datasheet: https://www.ti.com/cn/lit/gpn/tps5430; Supplier: LCSC; Function: 降压型; Output Type: 可调; Input Voltage: 5.5V~36V; Output Voltage: 1.221V~32.04V; Output Current (Max): 3A; Switching Frequency: 500kHz; Operating Temperature: -40℃~+125℃@(TJ); Synchronous Rectification: 否; Number of Outputs: 1; Topology: 降压式; Switch tube (built-in/external): 内置
U5 = AMS1117-3.3_C6186: 输出类型:固定;最大输入电压:-;输出电压:3.3V;最大输出电流:1A;电源纹波抑制比(PSRR):72dB@(120Hz);输出极性:正极;; LCSC Part Name: 输出3.3V 1A; Supplier Part: C6186; Manufacturer: AMS; Supplier Footprint: SOT-223; JLCPCB Part Class: 基础库; Datasheet: https://atta.szlcsc.com/upload/public/pdf/source/20180727/C6186_7A095716F0823C02F1997A905E26C086.pdf; Supplier: LCSC; Output Type: 固定; Output Voltage: 3.3V; MAX Output Current: 1A; Power Supply Rejection Ratio (PSRR): 72dB@(120Hz); Dropout Voltage: 1.3V@(800mA); Output Polarity: 正极; Number of Outputs: 1
U6 U7 = MAX3051EKA+T: 类型:收发器;数据速率:1Mbps;; LCSC Part Name: 1Mbps 3.14V~3.47V; Supplier Part: C112005; Manufacturer: ADI(亚德诺)/MAXIM(美信); Supplier Footprint: SOT-23-8; JLCPCB Part Class: 扩展库; Datasheet: https://atta.szlcsc.com/upload/public/pdf/source/20180126/C143406_15169558780381308928.pdf; Supplier: LCSC; Type: 收发器; Data Rate: 1Mbps; Supply Voltage: 3.14V~3.47V; Operating Temperature: -40℃~+85℃
U8 = ULN2003D1013TR: 通道数:七路;集射击穿电压(Vceo):50V;; Supplier Part: C61273; Manufacturer: ST(意法半导体); Supplier Footprint: SOIC-16; JLCPCB Part Class: 扩展库; Datasheet: https://atta.szlcsc.com/upload/public/pdf/source/20171116/C93000_15108227945891124497.pdf; Supplier: LCSC; number of channels: 七路; Maximum collector Emitter Voltage (Vceo): 50V
C33 = CC0805KRX7R9BB104: 容值:100nF;精度:±10%;额定电压:50V;材质(温度系数):X7R;; LCSC Part Name: 100nF ±10% 50V; Supplier Part: C49678; Manufacturer: YAGEO(国巨); Supplier Footprint: 0805; JLCPCB Part Class: 基础库; Datasheet: https://atta.szlcsc.com/upload/public/pdf/source/20180224/C181747_15194369449651363981.pdf; Supplier: LCSC; Tolerance: ±10%; Voltage Rated: 50V; Temperature Coefficient: X7R
C35 = CL10A105KB8NNNC: 容值:1uF;精度:±10%;额定电压:50V;材质(温度系数):X5R;; LCSC Part Name: 1uF ±10% 50V; Supplier Part: C15849; Manufacturer: SAMSUNG(三星); Supplier Footprint: 0603; JLCPCB Part Class: 基础库; Datasheet: https://atta.szlcsc.com/upload/public/pdf/source/20160218/1457707763339.pdf; Supplier: LCSC; Tolerance: ±10%; Voltage Rated: 50V; Temperature Coefficient: X5R
H4-H8 = PZ254V-11-03P: 插针结构:1x3P;间距:2.54mm;行距:-;圆针/方针:方针;安装类型:直插;排数:单排;总PIN位数:3P;额定电流:3A;额定电压:250V;配合针长度:6mm;塑高:2.5mm;端接针长度:3mm;工作温度范围:-40℃~+105℃;颜色:黑色;; LCSC Part Name: 间距:2.54mm 1x3P 直插 方针; Supplier Part: C2937625; Manufacturer: XFCN(兴飞); Supplier Footprint: 插件,P=2.54mm; JLCPCB Part Class: 扩展库; Datasheet: https://atta.szlcsc.com/upload/public/pdf/source/20200309/C492402_8335C3D49C4E4C618838D59BB1D024C1.pdf; Supplier: LCSC; Pin Structure: 1x3P; Pitch: 2.54mm; Circluar Pins/Square Pins: 方针; Mounting Type: 直插; Number of Rows: 单排; Number of Pins: 3P; Current Rating (Max): 3A; Voltage Rating (Max): 250V; Length of Mating Pin: 6mm; Insulation Height: 2.5mm; Length of End Connection Pin: 3mm; Operating Temperature Range: -40℃~+105℃; Color: 黑色
LED13 = LED_0603-G: Supplier Footprint: 0603
U10 = ICM-42688-P: 传感器类型:加速度计陀螺仪;; Supplier Part: C1850418; Manufacturer: TDK InvenSense(应美盛); Supplier Footprint: LGA-14(2.5x3); JLCPCB Part Class: 扩展库; Datasheet: https://atta.szlcsc.com/upload/public/pdf/source/20210703/CF24204867ACE5B754A2B035F23E5931.pdf; Supplier: LCSC; Sensor Type: 加速度计陀螺仪

## Nets
3.3V: C33.2 C35.2 H4.3 H5.3 H6.3 H7.3
3V3: C8.2 C9.2 C10.2 C11.2 C12.2 C19.2 C23.2 C28.2 C29.2 C30.2 CN1.2 CN11.2 CN13.2 H1.4 H2.7 L1.1 LEDW1.2(A) R2.2 R13.1 R29.1 R30.1 R31.1 R32.1 R38.2 SW2.1(A) U1.1(VBAT) U1.19(VDD) U1.32(VDD) U1.48(VDD) U1.64(VDD) U6.3(VCC) U7.3(VCC) U10.5(VDDIO) U10.8(VDD) U12.2 U13.1 U13.3 U13.5 U13.7 U13.9 U15.2
+5V: C31.2 LED2.1(VDD) R12.1 R37.2 U5.3(VIN) U12.3 U14.1 U14.3 U14.5 U14.7 U14.9 U15.3 U16.1
AGND: C1.2 C2.2 C5.1 C6.1 C7.1 C8.1 C9.1 C10.1 C11.1 C12.1 C19.1 C20.2 C21.1 C22.2 C23.1 C24.2 C25.1 C26.2 CN1.1 CN11.1 CN13.1 H1.3 LED2.3(GND) R36.2 U1.12(VSSA) U1.18(VSS) U1.63(VSS) U2.2 U6.2(GND) U6.8(RS) U7.2(GND) U7.8(RS) U12.1 U15.1 U16.2 X1.2(GND) X1.4(GND)
GND: C3.2 C4.2 C13.1 C14.1 C16.2 C27.2 C28.1 C29.1 C30.1 C31.1 C32.1 C33.1 C35.1 CN2.2 D2.2(A) H2.2 H4.1 H5.1 H6.1 H7.1 LED3.1(C) LED4.1(C) LED5.1(C) LED14.1(C) LED15.1(C) R1.2 R4.1 R9.1 R11.2 R36.1 RN1.1 RN1.2 RN1.3 RN1.4 U4.6(GND) U4.9(PowerPAD) U5.1(GND) U8.7(7B) U8.8(E) U10.6(GND) U10.7(RESV) U13.2 U13.4 U13.6 U13.8 U13.10 U14.2 U14.4 U14.6 U14.8 U14.10
VIN: CN2.1 SW3.1
AP_CS: R25.2 U10.12(AP_CS)
AP_SCLK: R26.2 U10.13(AP_SCL/AP_SCLK)
AP_SDI: R27.2 U10.14(AP_SDA/AP_SDIO/AP_SDI)
AP_SDO: R28.2 U10.1(AP_SDO/AP_AD0)
CAN1_N: C22.1 CN3.2 R16.1 U6.6(CANL)
CAN1_P: C21.2 CN3.1 R15.1 U6.7(CANH)
CAN2_N: C26.1 CN4.2 R18.1 U7.6(CANL)
CAN2_P: C25.2 CN4.1 R17.1 U7.7(CANH)
ENC1-CLK: R34.1 U16.4
ENC1-CS: R33.1 U16.3
ENC1-DI: R43.1 U16.5
ENC1-DO: R35.1 U16.6
LS1: CN5.1 LED6.1(C) U8.16(1C)
LS2: CN6.1 LED7.1(C) U8.15(2C)
LS3: CN7.1 LED8.1(C) U8.14(3C)
LS4: CN8.1 LED9.1(C) U8.13(4C)
LS5: CN9.1 LED10.1(C) U8.12(5C)
LS6: CN10.1 LED11.1(C) U8.11(6C)
NRST: C5.2 R2.1 R3.1 U1.7(NRST) U2.1
PA0-UART4_TX: R40.2 U1.14(PA0-WKUP(PA0))
PA1-UART4_RX: R39.1 U1.15(PA1)
PA2-USART2_TX: CN13.3 U1.16(PA2)
PA3-USART2_RX: CN13.4 U1.17(PA3)
PA4-SPI1_NSS: R33.2 U1.20(PA4)
PA5-SPI1_SCK: R34.2 U1.21(PA5)
PA6-SPI1_MISO: R35.2 U1.22(PA6)
PA7-SPI1_MOSI: R43.2 U1.23(PA7)
PA8_I2C3_SCL: U1.41(PA8) U12.4
PA9-USART1_TX: U1.42(PA9) U15.4
PA10-USART1_RX: U1.43(PA10) U15.5
PA11-CAN1_RX: U1.44(PA11) U6.4(RXD)
PA12-CAN1_TX: U1.45(PA12) U6.1(TXD)
PA13_JTMS/SWDIO: H1.2 U1.46(PA13(JTMS-SWDIO))
PA14_JTCK/SWCLK: H1.1 U1.49(PA14(JTCK-SWCLK))
PA15(JTDI): H8.3 U1.50(PA15(JTDI))
PB0: H6.2 U1.26(PB0)
PB1: H7.2 U1.27(PB1)
PB2-BOOT1(PB2): H8.2 U1.28(PB2-BOOT1(PB2))
PB3-CYL6: U1.55(PB3(JTDOTRACESWO)) U8.6(6B)
PB4-CYL5: U1.56(PB4(NJTRST)) U8.5(5B)
PB5-CYL4: U1.57(PB5) U8.4(4B)
PB6-I2C1_SCL: CN1.3 U1.58(PB6)
PB7-I2C1_SDA: CN1.4 U1.59(PB7)
PB8_RGB: LED2.4(DIN) U1.61(PB8)
PB9-SPI2_NSS: R25.1 U1.62(PB9)
PB10-SPI2_SCK: R26.1 U1.29(PB10)
PB11: H8.1 U1.30(PB11)
PB12-CAN2_RX: U1.33(PB12) U7.4(RXD)
PB13-CAN2_TX: U1.34(PB13) U7.1(TXD)
PB14_KEY3: RN1.8 SW2.4(CENTER) U1.35(PB14)
PB15_KEY4: RN1.7 SW2.5(D) U1.36(PB15)
PC0-EXTI0_INT1: LED12.1(C) R29.2 U1.8(PC0) U10.4(INT1/INT)
PC1-EXTI1_INT2: LED13.1(C) R31.2 U1.9(PC1) U10.9(INT2/FSYNC/CLKIN)
PC2-SPI2_MISO: R28.1 U1.10(PC2)
PC3-SPI2_MOSI: R27.1 U1.11(PC3)
PC4: H4.2 U1.24(PC4)
PC5: H5.2 U1.25(PC5)
PC6_KEY5: RN1.6 SW2.6(COMMON) U1.37(PC6)
PC7_KEY2: RN1.5 SW2.3(C) U1.38(PC7)
PC8_KEY1: R4.2 SW2.2(B) U1.39(PC8)
PC9_I2C3_SDA: U1.40(PC9) U12.5
PC10: R41.1 U1.51(PC10)
PC11: R42.1 U1.52(PC11)
PC12-UART5_TX: CN11.3 U1.53(PC12)
PC13-CYL3: U1.2(PC13) U8.3(3B)
PC14-CYL2: U1.3(PC14-OSC32_IN(PC14)) U8.2(2B)
PC15-CYL1: U1.4(PC15-OSC32_OUT(PC15)) U8.1(1B)
PD2-UART5_RX: CN11.4 U1.54(PD2)
PH0-OSC_IN: C6.2 U1.5(PH0-OSC_IN(PH0)) X1.3(OSC2)
PH1-OSC_OUT: C7.2 U1.6(PH1-OSC_OUT(PH1)) X1.1(OSC1)
VOUT: C13.2 C14.2 C27.1 CN5.2 CN6.2 CN7.2 CN8.2 CN9.2 CN10.2 D1.1(K) Q1.2(S) R14.1 R19.1 R20.1 R21.1 R22.1 R23.1 R24.1 U4.7(VIN) U8.9(COM)
$1N1219: C1.1 C2.1 L1.2 U1.13(VDDA)
$1N2057: R1.1 U1.60(BOOT0)
$1N2161: C3.1 U1.31(VCAP_1)
$1N2164: C4.1 U1.47(VCAP_2)
$1N2341: LEDW1.1(C) R3.2
$1N10699: LED14.2(A) R41.2
$1N10726: LED15.2(A) R42.2
$2N592: F2.2 Q1.3(D)
$2N681: D1.2(A) Q1.1(G) R9.2
$2N1442: C15.1 U4.1(BOOT)
$2N1445: C15.2 D2.1(K) L2.1 U4.8(PH)
$2N1741: C16.1 L2.2 R10.2 R37.1
$2N1785: R10.1 R11.1 U4.4(VSENSE)
$2N2095: C32.2 R38.1 U5.2(VOUT) U5.4(VOUT)
$2N2279: LED3.2(A) R12.2
$2N2306: LED4.2(A) R13.2
$2N2333: LED5.2(A) R14.2
$2N3054: C20.1 R15.2 R16.2
$2N3588: C24.1 R17.2 R18.2
$2N4408: LED6.2(A) R19.2
$2N4549: LED7.2(A) R20.2
$2N4660: LED8.2(A) R21.2
$2N4771: LED9.2(A) R22.2
$2N4882: LED10.2(A) R23.2
$2N4993: LED11.2(A) R24.2
$2N7461: H2.1 R39.2
$2N7487: H2.8 R40.1
$2N9009: F2.1 SW3.2
$3N791: LED12.2(A) R30.2
$3N966: LED13.2(A) R32.2

Not connected (* = marked no-connect by the designer): H2 3* 4* 5* 6*; LED2 2(DOU)*; SCREW1 1*; SCREW2 1*; SCREW3 1*; SCREW4 1*; SW3 3* 4* 5* 6*; U4 2(NC)* 3(NC)* 5(ENA)*; U6 5(SHDN)*; U7 5(SHDN)*; U8 10(7C)*; U10 2(RESV)* 3(RESV)* 10(RESV)* 11(RESV)*

## Notes on the sheets
sheet 1
- 触发时检测为高电平
- 数字RGB
- 五向开关
- 按键复位
- 外部时钟
- 烧录接口
- I2C1
- UART5
- UART2
- SPI1
- MCU
- I2C3
- UART1
- 拓展接口
- 其他
sheet 2
- 引脚上拉为启动电磁阀，指示灯点亮
- 供电
- 电磁阀控制
- 差分信号
- 接一转四转接板
- CAN总线
- 测试前先确认RX与TX位置
- UART4
- WIFI模块
sheet 3
- ADC
- 未使用的引脚以排针引出
- SPI2
- ADC
- IMU
